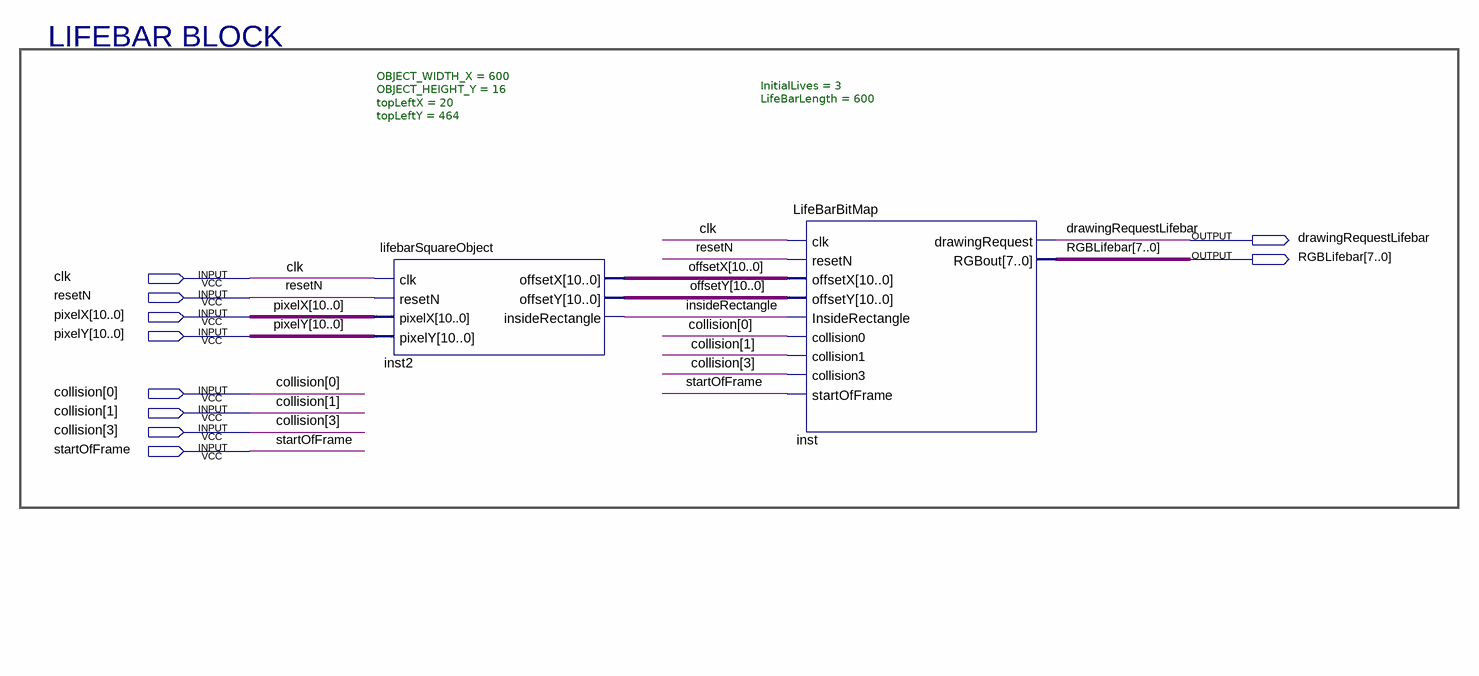
[diagram p0: schematic sheet]
// Quartus schematic LIFEBAR_BLOCK.bdf as structural Verilog: 2 symbols, 10 pins
module LIFEBAR_BLOCK (
  input  clk,
  input  resetN,
  input  [10:0] pixelX,
  input  [10:0] pixelY,
  input  [3:0] collision,
  input  startOfFrame,
  output drawingRequestLifebar,
  output [7:0] RGBLifebar
);

  wire insideRectangle;
  wire [10:0] offsetX, offsetY;

  lifebarSquareObject #(.OBJECT_WIDTH_X(600), .OBJECT_HEIGHT_Y(16), .topLeftX(20), .topLeftY(464)) inst2 (
    .clk(clk), .resetN(resetN), .pixelX(pixelX), .pixelY(pixelY), .offsetX(offsetX), .offsetY(offsetY),
    .insideRectangle(insideRectangle));
  LifeBarBitMap #(.InitialLives(3), .LifeBarLength(600)) inst (
    .clk(clk), .resetN(resetN), .offsetX(offsetX), .offsetY(offsetY), .InsideRectangle(insideRectangle),
    .collision0(collision[0]), .collision1(collision[1]), .collision3(collision[3]),
    .startOfFrame(startOfFrame), .drawingRequest(drawingRequestLifebar), .RGBout(RGBLifebar));

  // Notes on the sheet:
  //   LIFEBAR BLOCK
endmodule
